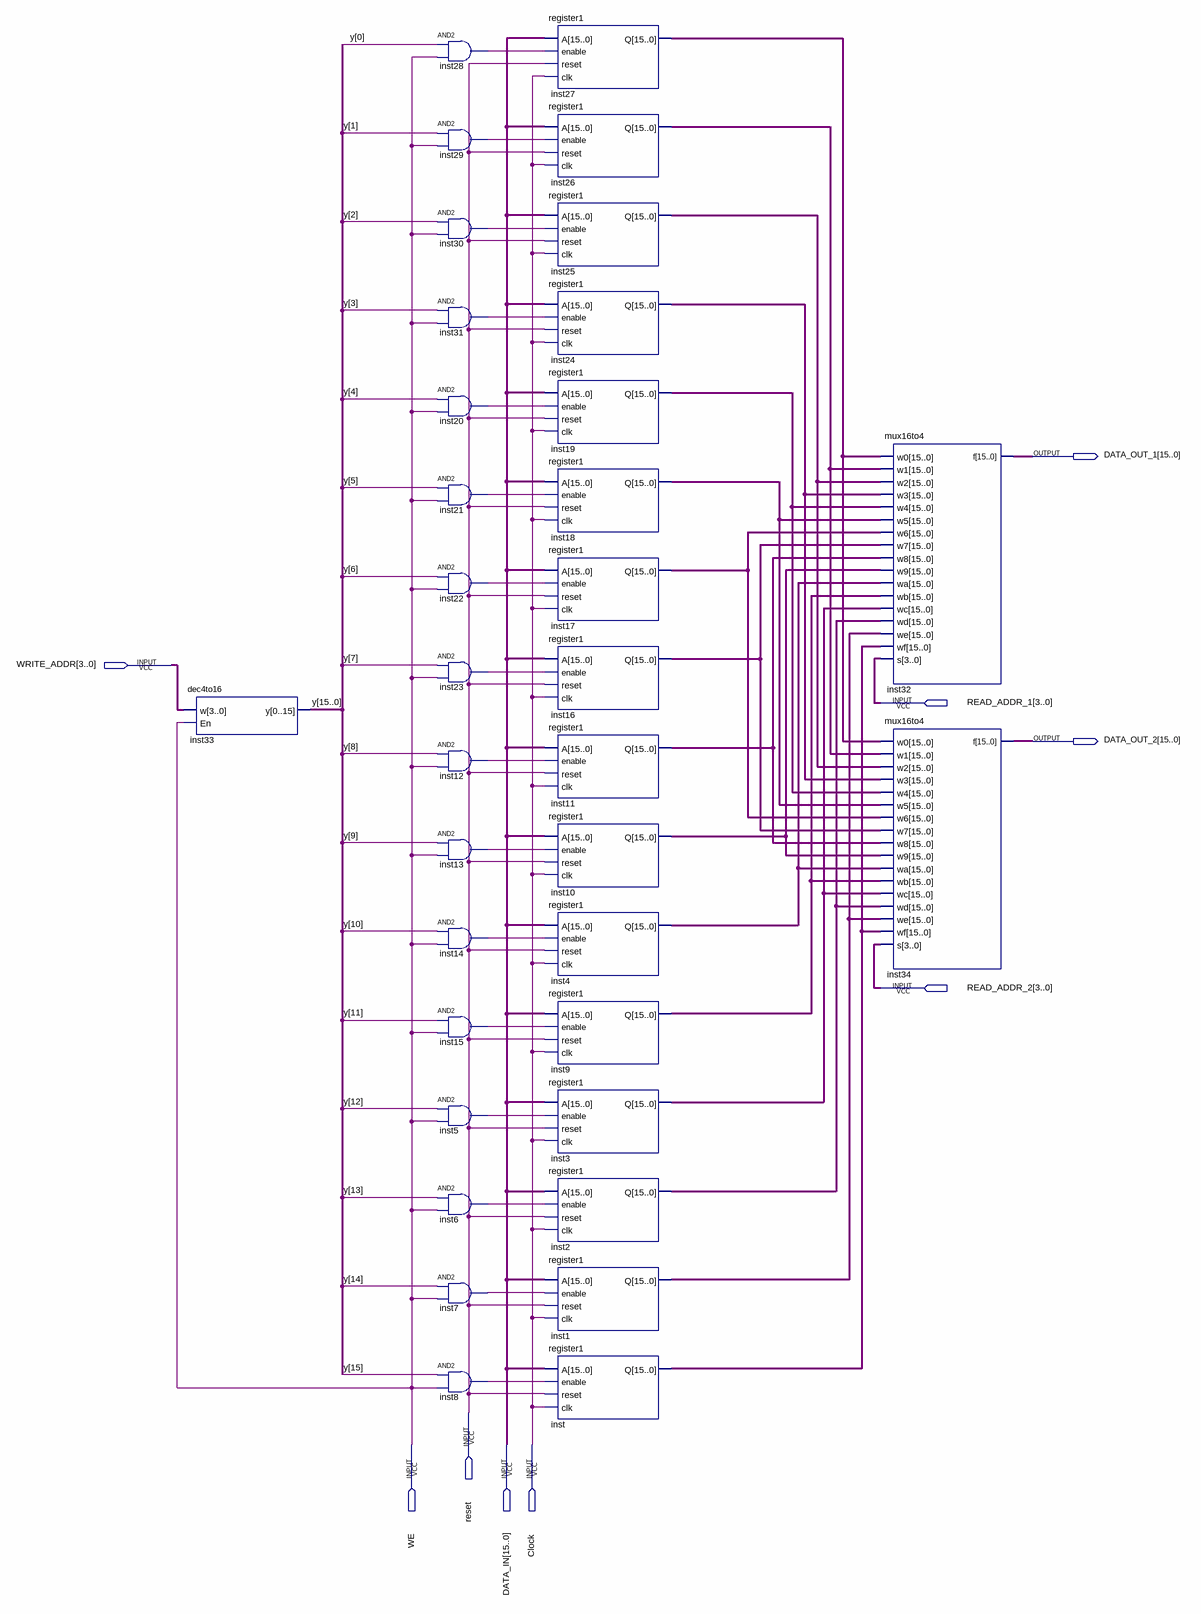
[diagram p0: schematic sheet]
// Quartus schematic registerFile_16x16.bdf as structural Verilog: 35 symbols, 9 pins
module registerFile_16x16 (
  input  [3:0] WRITE_ADDR,
  input  [3:0] READ_ADDR_1,
  input  [3:0] READ_ADDR_2,
  input  reset,
  input  WE,
  input  [15:0] DATA_IN,
  input  Clock,
  output [15:0] DATA_OUT_1,
  output [15:0] DATA_OUT_2
);

  wire inst5_out, inst6_out, inst7_out, inst8_out, inst12_out, inst13_out, inst14_out, inst15_out,
       inst20_out, inst21_out, inst22_out, inst23_out, inst28_out, inst29_out, inst30_out, inst31_out;
  wire [15:0] inst1_q, inst2_q, inst3_q, inst4_q, inst9_q, inst10_q, inst11_q, inst16_q, inst17_q, inst18_q,
       inst19_q, inst24_q, inst25_q, inst26_q, inst27_q, inst_q, y;

  dec4to16 inst33 (.w(WRITE_ADDR), .En(WE), .y(y));
  and inst28 (inst28_out, y[0], WE);
  and inst29 (inst29_out, y[1], WE);
  and inst30 (inst30_out, y[2], WE);
  and inst31 (inst31_out, y[3], WE);
  and inst20 (inst20_out, y[4], WE);
  and inst21 (inst21_out, y[5], WE);
  and inst22 (inst22_out, y[6], WE);
  and inst23 (inst23_out, y[7], WE);
  and inst12 (inst12_out, y[8], WE);
  and inst13 (inst13_out, y[9], WE);
  and inst14 (inst14_out, y[10], WE);
  and inst15 (inst15_out, y[11], WE);
  and inst5 (inst5_out, y[12], WE);
  and inst6 (inst6_out, y[13], WE);
  and inst7 (inst7_out, y[14], WE);
  and inst8 (inst8_out, y[15], WE);
  register1 inst27 (.A(DATA_IN), .enable(inst28_out), .reset(reset), .clk(Clock), .Q(inst27_q));
  register1 inst26 (.A(DATA_IN), .enable(inst29_out), .reset(reset), .clk(Clock), .Q(inst26_q));
  register1 inst25 (.A(DATA_IN), .enable(inst30_out), .reset(reset), .clk(Clock), .Q(inst25_q));
  register1 inst24 (.A(DATA_IN), .enable(inst31_out), .reset(reset), .clk(Clock), .Q(inst24_q));
  register1 inst19 (.A(DATA_IN), .enable(inst20_out), .reset(reset), .clk(Clock), .Q(inst19_q));
  register1 inst18 (.A(DATA_IN), .enable(inst21_out), .reset(reset), .clk(Clock), .Q(inst18_q));
  register1 inst17 (.A(DATA_IN), .enable(inst22_out), .reset(reset), .clk(Clock), .Q(inst17_q));
  register1 inst16 (.A(DATA_IN), .enable(inst23_out), .reset(reset), .clk(Clock), .Q(inst16_q));
  register1 inst11 (.A(DATA_IN), .enable(inst12_out), .reset(reset), .clk(Clock), .Q(inst11_q));
  register1 inst10 (.A(DATA_IN), .enable(inst13_out), .reset(reset), .clk(Clock), .Q(inst10_q));
  register1 inst4 (.A(DATA_IN), .enable(inst14_out), .reset(reset), .clk(Clock), .Q(inst4_q));
  register1 inst9 (.A(DATA_IN), .enable(inst15_out), .reset(reset), .clk(Clock), .Q(inst9_q));
  register1 inst3 (.A(DATA_IN), .enable(inst5_out), .reset(reset), .clk(Clock), .Q(inst3_q));
  register1 inst2 (.A(DATA_IN), .enable(inst6_out), .reset(reset), .clk(Clock), .Q(inst2_q));
  register1 inst1 (.A(DATA_IN), .enable(inst7_out), .reset(reset), .clk(Clock), .Q(inst1_q));
  register1 inst (.A(DATA_IN), .enable(inst8_out), .reset(reset), .clk(Clock), .Q(inst_q));
  mux16to4 inst32 (
    .w0(inst27_q), .w1(inst26_q), .w2(inst25_q), .w3(inst24_q), .w4(inst19_q), .w5(inst18_q), .w6(inst17_q),
    .w7(inst16_q), .w8(inst11_q), .w9(inst10_q), .wa(inst4_q), .wb(inst9_q), .wc(inst3_q), .wd(inst2_q),
    .we(inst1_q), .wf(inst_q), .s(READ_ADDR_1), .f(DATA_OUT_1));
  mux16to4 inst34 (
    .w0(inst27_q), .w1(inst26_q), .w2(inst25_q), .w3(inst24_q), .w4(inst19_q), .w5(inst18_q), .w6(inst17_q),
    .w7(inst16_q), .w8(inst11_q), .w9(inst10_q), .wa(inst4_q), .wb(inst9_q), .wc(inst3_q), .wd(inst2_q),
    .we(inst1_q), .wf(inst_q), .s(READ_ADDR_2), .f(DATA_OUT_2));
endmodule
